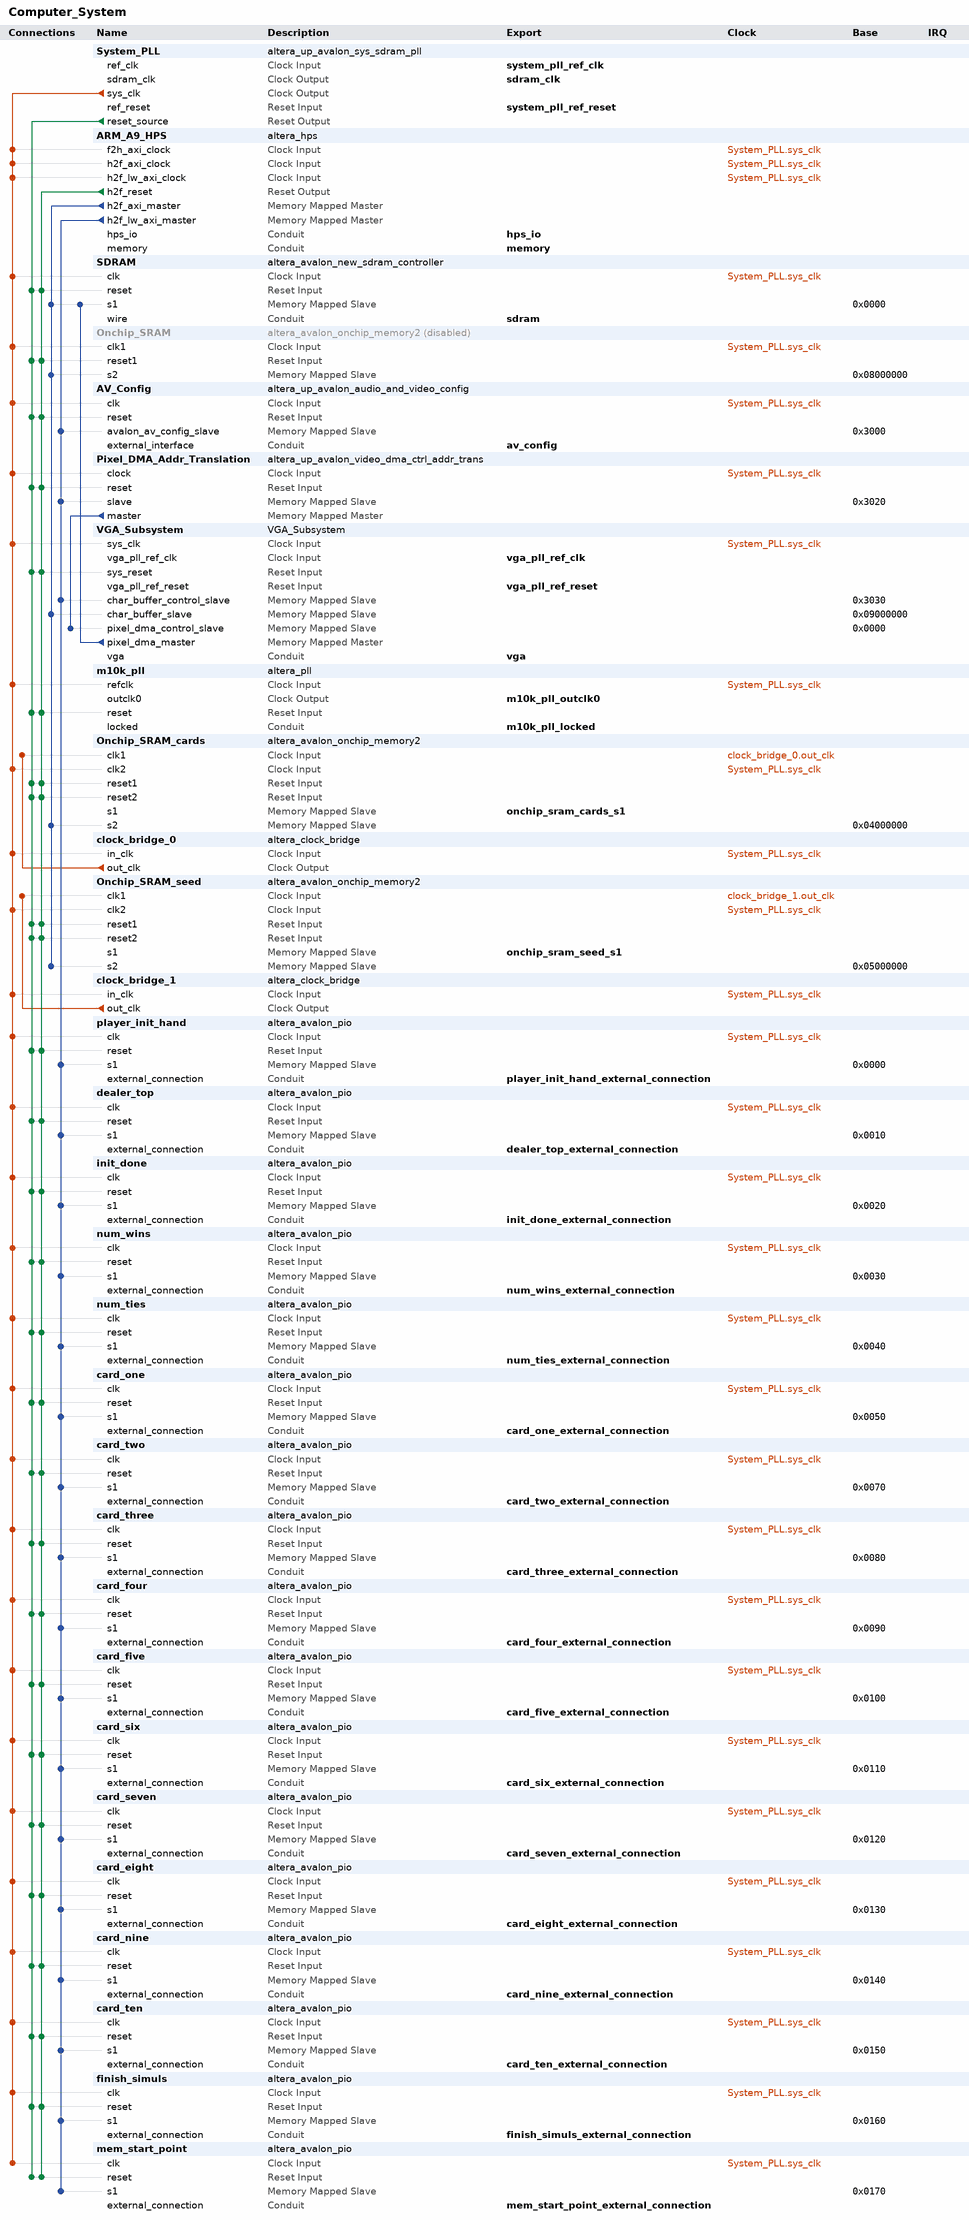
[diagram p0: system contents]
# Platform Designer (Qsys) system Computer_System, Cyclone V 5CSEMA5F31C6
# Parameters at their usual value, and those the tool derives, are not listed.
package require -exact qsys 18.1
create_system Computer_System
set_project_property DEVICE_FAMILY {Cyclone V}
set_project_property DEVICE 5CSEMA5F31C6

add_instance System_PLL altera_up_avalon_sys_sdram_pll 18.0
set_instance_parameter_value System_PLL CV_boards DE1-SoC
set_instance_parameter_value System_PLL gui_outclk 100.0
set_instance_parameter_value System_PLL gui_refclk 50.0

add_instance ARM_A9_HPS altera_hps 18.1
set_instance_parameter_value ARM_A9_HPS EMAC1_Mode RGMII
set_instance_parameter_value ARM_A9_HPS EMAC1_PinMuxing {HPS I/O Set 0}
set_instance_parameter_value ARM_A9_HPS F2SCLK_COLDRST_Enable false
set_instance_parameter_value ARM_A9_HPS F2SCLK_DBGRST_Enable false
set_instance_parameter_value ARM_A9_HPS F2SCLK_WARMRST_Enable false
set_instance_parameter_value ARM_A9_HPS F2SINTERRUPT_Enable true
set_instance_parameter_value ARM_A9_HPS F2S_Width 2
set_instance_parameter_value ARM_A9_HPS FPGA_PERIPHERAL_OUTPUT_CLOCK_FREQ_EMAC0_GTX_CLK 125
set_instance_parameter_value ARM_A9_HPS FPGA_PERIPHERAL_OUTPUT_CLOCK_FREQ_EMAC0_MD_CLK 100.0
set_instance_parameter_value ARM_A9_HPS FPGA_PERIPHERAL_OUTPUT_CLOCK_FREQ_EMAC1_GTX_CLK 125
set_instance_parameter_value ARM_A9_HPS FPGA_PERIPHERAL_OUTPUT_CLOCK_FREQ_EMAC1_MD_CLK 100.0
set_instance_parameter_value ARM_A9_HPS HPS_PROTOCOL DDR3
set_instance_parameter_value ARM_A9_HPS I2C0_Mode I2C
set_instance_parameter_value ARM_A9_HPS I2C0_PinMuxing {HPS I/O Set 0}
set_instance_parameter_value ARM_A9_HPS I2C1_Mode I2C
set_instance_parameter_value ARM_A9_HPS I2C1_PinMuxing {HPS I/O Set 0}
set_instance_parameter_value ARM_A9_HPS LWH2F_Enable true
set_instance_parameter_value ARM_A9_HPS MEM_BANKADDR_WIDTH 3
set_instance_parameter_value ARM_A9_HPS MEM_CLK_FREQ 400.0
set_instance_parameter_value ARM_A9_HPS MEM_COL_ADDR_WIDTH 10
set_instance_parameter_value ARM_A9_HPS MEM_DQ_WIDTH 32
set_instance_parameter_value ARM_A9_HPS MEM_DRV_STR RZQ/7
set_instance_parameter_value ARM_A9_HPS MEM_ROW_ADDR_WIDTH 15
set_instance_parameter_value ARM_A9_HPS MEM_RTT_NOM RZQ/4
set_instance_parameter_value ARM_A9_HPS MEM_RTT_WR RZQ/4
set_instance_parameter_value ARM_A9_HPS MEM_TCL 11
set_instance_parameter_value ARM_A9_HPS MEM_TFAW_NS 30.0
set_instance_parameter_value ARM_A9_HPS MEM_TRAS_NS 35.0
set_instance_parameter_value ARM_A9_HPS MEM_TRCD_NS 13.75
set_instance_parameter_value ARM_A9_HPS MEM_TRFC_NS 260.0
set_instance_parameter_value ARM_A9_HPS MEM_TRP_NS 13.75
set_instance_parameter_value ARM_A9_HPS MEM_VENDOR JEDEC
set_instance_parameter_value ARM_A9_HPS MEM_WTCL 8
set_instance_parameter_value ARM_A9_HPS QSPI_Mode {1 SS}
set_instance_parameter_value ARM_A9_HPS QSPI_PinMuxing {HPS I/O Set 0}
set_instance_parameter_value ARM_A9_HPS REF_CLK_FREQ 25.0
set_instance_parameter_value ARM_A9_HPS S2FCLK_USER2CLK 5
set_instance_parameter_value ARM_A9_HPS S2F_Width 3
set_instance_parameter_value ARM_A9_HPS SDIO_Mode {4-bit Data}
set_instance_parameter_value ARM_A9_HPS SDIO_PinMuxing {HPS I/O Set 0}
set_instance_parameter_value ARM_A9_HPS SPIM1_Mode {Single Slave Select}
set_instance_parameter_value ARM_A9_HPS SPIM1_PinMuxing {HPS I/O Set 0}
set_instance_parameter_value ARM_A9_HPS STM_Enable false
set_instance_parameter_value ARM_A9_HPS TIMING_BOARD_AC_SKEW 0.03
set_instance_parameter_value ARM_A9_HPS TIMING_BOARD_AC_TO_CK_SKEW 0.0
set_instance_parameter_value ARM_A9_HPS TIMING_BOARD_DQ_TO_DQS_SKEW 0.0
set_instance_parameter_value ARM_A9_HPS TIMING_BOARD_MAX_CK_DELAY 0.03
set_instance_parameter_value ARM_A9_HPS TIMING_BOARD_MAX_DQS_DELAY 0.02
set_instance_parameter_value ARM_A9_HPS TIMING_BOARD_SKEW_BETWEEN_DQS 0.08
set_instance_parameter_value ARM_A9_HPS TIMING_BOARD_SKEW_CKDQS_DIMM_MAX 0.16
set_instance_parameter_value ARM_A9_HPS TIMING_BOARD_SKEW_CKDQS_DIMM_MIN 0.09
set_instance_parameter_value ARM_A9_HPS TIMING_BOARD_SKEW_WITHIN_DQS 0.01
set_instance_parameter_value ARM_A9_HPS TIMING_TDH 65
set_instance_parameter_value ARM_A9_HPS TIMING_TDQSCK 255
set_instance_parameter_value ARM_A9_HPS TIMING_TDQSQ 125
set_instance_parameter_value ARM_A9_HPS TIMING_TDS 30
set_instance_parameter_value ARM_A9_HPS TIMING_TIH 140
set_instance_parameter_value ARM_A9_HPS TIMING_TIS 180
set_instance_parameter_value ARM_A9_HPS TIMING_TQSH 0.4
set_instance_parameter_value ARM_A9_HPS UART0_Mode {No Flow Control}
set_instance_parameter_value ARM_A9_HPS UART0_PinMuxing {HPS I/O Set 0}
set_instance_parameter_value ARM_A9_HPS USB1_Mode SDR
set_instance_parameter_value ARM_A9_HPS USB1_PinMuxing {HPS I/O Set 0}
set_instance_parameter_value ARM_A9_HPS desired_cfg_clk_mhz 100.0
set_instance_parameter_value ARM_A9_HPS desired_qspi_clk_mhz 400.0

add_instance SDRAM altera_avalon_new_sdram_controller 18.1
set_instance_parameter_value SDRAM TAC 5.5
set_instance_parameter_value SDRAM TRCD 20.0
set_instance_parameter_value SDRAM TRP 20.0
set_instance_parameter_value SDRAM casLatency 3
set_instance_parameter_value SDRAM columnWidth 10
set_instance_parameter_value SDRAM dataWidth 16
set_instance_parameter_value SDRAM generateSimulationModel true
set_instance_parameter_value SDRAM model single_Micron_MT48LC4M32B2_7_chip
set_instance_parameter_value SDRAM numberOfBanks 4
set_instance_parameter_value SDRAM numberOfChipSelects 1
set_instance_parameter_value SDRAM powerUpDelay 100.0
set_instance_parameter_value SDRAM refreshPeriod 15.625
set_instance_parameter_value SDRAM rowWidth 13

add_instance Onchip_SRAM altera_avalon_onchip_memory2 18.1
set_instance_property Onchip_SRAM ENABLED false
set_instance_parameter_value Onchip_SRAM dataWidth 8
set_instance_parameter_value Onchip_SRAM dualPort true
set_instance_parameter_value Onchip_SRAM initMemContent false
set_instance_parameter_value Onchip_SRAM initializationFileName onchip_mem.hex
set_instance_parameter_value Onchip_SRAM memorySize 131072
set_instance_parameter_value Onchip_SRAM singleClockOperation true

add_instance AV_Config altera_up_avalon_audio_and_video_config 18.0
set_instance_parameter_value AV_Config audio_in {Microphone to ADC}
set_instance_parameter_value AV_Config bit_length 32
set_instance_parameter_value AV_Config board DE1-SoC
set_instance_parameter_value AV_Config line_in_bypass false
set_instance_parameter_value AV_Config sampling_rate {48 kHz}

add_instance Pixel_DMA_Addr_Translation altera_up_avalon_video_dma_ctrl_addr_trans 18.0

add_instance VGA_Subsystem VGA_Subsystem 1.0

add_instance m10k_pll altera_pll 18.1
set_instance_parameter_value m10k_pll gui_device_speed_grade 1
set_instance_parameter_value m10k_pll gui_number_of_clocks 1
set_instance_parameter_value m10k_pll gui_operation_mode direct
set_instance_parameter_value m10k_pll gui_output_clock_frequency0 100.0
set_instance_parameter_value m10k_pll gui_pll_mode {Integer-N PLL}
set_instance_parameter_value m10k_pll gui_reference_clock_frequency 100.0
set_instance_parameter_value m10k_pll gui_use_locked true

add_instance Onchip_SRAM_cards altera_avalon_onchip_memory2 18.1
set_instance_parameter_value Onchip_SRAM_cards blockType M10K
set_instance_parameter_value Onchip_SRAM_cards dataWidth 32
set_instance_parameter_value Onchip_SRAM_cards dualPort true
set_instance_parameter_value Onchip_SRAM_cards initMemContent true
set_instance_parameter_value Onchip_SRAM_cards initializationFileName onchip_mem.hex
set_instance_parameter_value Onchip_SRAM_cards memorySize 1248

add_instance clock_bridge_0 altera_clock_bridge 18.1
set_instance_parameter_value clock_bridge_0 DERIVED_CLOCK_RATE 100000000
set_instance_parameter_value clock_bridge_0 EXPLICIT_CLOCK_RATE 50000000

add_instance Onchip_SRAM_seed altera_avalon_onchip_memory2 18.1
set_instance_parameter_value Onchip_SRAM_seed blockType M10K
set_instance_parameter_value Onchip_SRAM_seed dataWidth 32
set_instance_parameter_value Onchip_SRAM_seed dualPort true
set_instance_parameter_value Onchip_SRAM_seed initMemContent true
set_instance_parameter_value Onchip_SRAM_seed initializationFileName onchip_mem.hex
set_instance_parameter_value Onchip_SRAM_seed memorySize 10000

add_instance clock_bridge_1 altera_clock_bridge 18.1
set_instance_parameter_value clock_bridge_1 DERIVED_CLOCK_RATE 100000000
set_instance_parameter_value clock_bridge_1 EXPLICIT_CLOCK_RATE 50000000

add_instance player_init_hand altera_avalon_pio 18.1
set_instance_parameter_value player_init_hand direction Output
set_instance_parameter_value player_init_hand width 8

add_instance dealer_top altera_avalon_pio 18.1
set_instance_parameter_value dealer_top direction Output
set_instance_parameter_value dealer_top width 8

add_instance init_done altera_avalon_pio 18.1
set_instance_parameter_value init_done direction Output
set_instance_parameter_value init_done width 8

add_instance num_wins altera_avalon_pio 18.1
set_instance_parameter_value num_wins direction Input
set_instance_parameter_value num_wins width 32

add_instance num_ties altera_avalon_pio 18.1
set_instance_parameter_value num_ties direction Input
set_instance_parameter_value num_ties width 32

add_instance card_one altera_avalon_pio 18.1
set_instance_parameter_value card_one direction Input
set_instance_parameter_value card_one width 32

add_instance card_two altera_avalon_pio 18.1
set_instance_parameter_value card_two direction Input
set_instance_parameter_value card_two width 32

add_instance card_three altera_avalon_pio 18.1
set_instance_parameter_value card_three direction Input
set_instance_parameter_value card_three width 32

add_instance card_four altera_avalon_pio 18.1
set_instance_parameter_value card_four direction Input
set_instance_parameter_value card_four width 32

add_instance card_five altera_avalon_pio 18.1
set_instance_parameter_value card_five direction Input
set_instance_parameter_value card_five width 32

add_instance card_six altera_avalon_pio 18.1
set_instance_parameter_value card_six direction Input
set_instance_parameter_value card_six width 32

add_instance card_seven altera_avalon_pio 18.1
set_instance_parameter_value card_seven direction Input
set_instance_parameter_value card_seven width 32

add_instance card_eight altera_avalon_pio 18.1
set_instance_parameter_value card_eight direction Input
set_instance_parameter_value card_eight width 32

add_instance card_nine altera_avalon_pio 18.1
set_instance_parameter_value card_nine direction Input
set_instance_parameter_value card_nine width 32

add_instance card_ten altera_avalon_pio 18.1
set_instance_parameter_value card_ten direction Input
set_instance_parameter_value card_ten width 32

add_instance finish_simuls altera_avalon_pio 18.1
set_instance_parameter_value finish_simuls direction Input
set_instance_parameter_value finish_simuls width 32

add_instance mem_start_point altera_avalon_pio 18.1
set_instance_parameter_value mem_start_point direction Output
set_instance_parameter_value mem_start_point width 32

# connections
add_connection clock_bridge_0.out_clk Onchip_SRAM_cards.clk1 clock
add_connection clock_bridge_1.out_clk Onchip_SRAM_seed.clk1 clock
add_connection System_PLL.sys_clk ARM_A9_HPS.f2h_axi_clock clock
add_connection System_PLL.sys_clk ARM_A9_HPS.h2f_axi_clock clock
add_connection System_PLL.sys_clk ARM_A9_HPS.h2f_lw_axi_clock clock
add_connection System_PLL.sys_clk AV_Config.clk clock
add_connection System_PLL.sys_clk card_eight.clk clock
add_connection System_PLL.sys_clk card_five.clk clock
add_connection System_PLL.sys_clk card_four.clk clock
add_connection System_PLL.sys_clk card_nine.clk clock
add_connection System_PLL.sys_clk card_one.clk clock
add_connection System_PLL.sys_clk card_seven.clk clock
add_connection System_PLL.sys_clk card_six.clk clock
add_connection System_PLL.sys_clk card_ten.clk clock
add_connection System_PLL.sys_clk card_three.clk clock
add_connection System_PLL.sys_clk card_two.clk clock
add_connection System_PLL.sys_clk clock_bridge_0.in_clk clock
add_connection System_PLL.sys_clk clock_bridge_1.in_clk clock
add_connection System_PLL.sys_clk dealer_top.clk clock
add_connection System_PLL.sys_clk finish_simuls.clk clock
add_connection System_PLL.sys_clk init_done.clk clock
add_connection System_PLL.sys_clk m10k_pll.refclk clock
add_connection System_PLL.sys_clk mem_start_point.clk clock
add_connection System_PLL.sys_clk num_ties.clk clock
add_connection System_PLL.sys_clk num_wins.clk clock
add_connection System_PLL.sys_clk Onchip_SRAM.clk1 clock
add_connection System_PLL.sys_clk Onchip_SRAM_cards.clk2 clock
add_connection System_PLL.sys_clk Onchip_SRAM_seed.clk2 clock
add_connection System_PLL.sys_clk Pixel_DMA_Addr_Translation.clock clock
add_connection System_PLL.sys_clk player_init_hand.clk clock
add_connection System_PLL.sys_clk SDRAM.clk clock
add_connection System_PLL.sys_clk VGA_Subsystem.sys_clk clock
add_connection ARM_A9_HPS.h2f_reset AV_Config.reset reset
add_connection ARM_A9_HPS.h2f_reset card_eight.reset reset
add_connection ARM_A9_HPS.h2f_reset card_five.reset reset
add_connection ARM_A9_HPS.h2f_reset card_four.reset reset
add_connection ARM_A9_HPS.h2f_reset card_nine.reset reset
add_connection ARM_A9_HPS.h2f_reset card_one.reset reset
add_connection ARM_A9_HPS.h2f_reset card_seven.reset reset
add_connection ARM_A9_HPS.h2f_reset card_six.reset reset
add_connection ARM_A9_HPS.h2f_reset card_ten.reset reset
add_connection ARM_A9_HPS.h2f_reset card_three.reset reset
add_connection ARM_A9_HPS.h2f_reset card_two.reset reset
add_connection ARM_A9_HPS.h2f_reset dealer_top.reset reset
add_connection ARM_A9_HPS.h2f_reset finish_simuls.reset reset
add_connection ARM_A9_HPS.h2f_reset init_done.reset reset
add_connection ARM_A9_HPS.h2f_reset m10k_pll.reset reset
add_connection ARM_A9_HPS.h2f_reset mem_start_point.reset reset
add_connection ARM_A9_HPS.h2f_reset num_ties.reset reset
add_connection ARM_A9_HPS.h2f_reset num_wins.reset reset
add_connection ARM_A9_HPS.h2f_reset Onchip_SRAM.reset1 reset
add_connection ARM_A9_HPS.h2f_reset Onchip_SRAM_cards.reset1 reset
add_connection ARM_A9_HPS.h2f_reset Onchip_SRAM_cards.reset2 reset
add_connection ARM_A9_HPS.h2f_reset Onchip_SRAM_seed.reset1 reset
add_connection ARM_A9_HPS.h2f_reset Onchip_SRAM_seed.reset2 reset
add_connection ARM_A9_HPS.h2f_reset Pixel_DMA_Addr_Translation.reset reset
add_connection ARM_A9_HPS.h2f_reset player_init_hand.reset reset
add_connection ARM_A9_HPS.h2f_reset SDRAM.reset reset
add_connection ARM_A9_HPS.h2f_reset VGA_Subsystem.sys_reset reset
add_connection System_PLL.reset_source AV_Config.reset reset
add_connection System_PLL.reset_source card_eight.reset reset
add_connection System_PLL.reset_source card_five.reset reset
add_connection System_PLL.reset_source card_four.reset reset
add_connection System_PLL.reset_source card_nine.reset reset
add_connection System_PLL.reset_source card_one.reset reset
add_connection System_PLL.reset_source card_seven.reset reset
add_connection System_PLL.reset_source card_six.reset reset
add_connection System_PLL.reset_source card_ten.reset reset
add_connection System_PLL.reset_source card_three.reset reset
add_connection System_PLL.reset_source card_two.reset reset
add_connection System_PLL.reset_source dealer_top.reset reset
add_connection System_PLL.reset_source finish_simuls.reset reset
add_connection System_PLL.reset_source init_done.reset reset
add_connection System_PLL.reset_source m10k_pll.reset reset
add_connection System_PLL.reset_source mem_start_point.reset reset
add_connection System_PLL.reset_source num_ties.reset reset
add_connection System_PLL.reset_source num_wins.reset reset
add_connection System_PLL.reset_source Onchip_SRAM.reset1 reset
add_connection System_PLL.reset_source Onchip_SRAM_cards.reset1 reset
add_connection System_PLL.reset_source Onchip_SRAM_cards.reset2 reset
add_connection System_PLL.reset_source Onchip_SRAM_seed.reset1 reset
add_connection System_PLL.reset_source Onchip_SRAM_seed.reset2 reset
add_connection System_PLL.reset_source Pixel_DMA_Addr_Translation.reset reset
add_connection System_PLL.reset_source player_init_hand.reset reset
add_connection System_PLL.reset_source SDRAM.reset reset
add_connection System_PLL.reset_source VGA_Subsystem.sys_reset reset
add_connection ARM_A9_HPS.h2f_axi_master Onchip_SRAM.s2 avalon
set_connection_parameter_value ARM_A9_HPS.h2f_axi_master/Onchip_SRAM.s2 baseAddress 0x08000000
add_connection ARM_A9_HPS.h2f_axi_master Onchip_SRAM_cards.s2 avalon
set_connection_parameter_value ARM_A9_HPS.h2f_axi_master/Onchip_SRAM_cards.s2 baseAddress 0x04000000
add_connection ARM_A9_HPS.h2f_axi_master Onchip_SRAM_seed.s2 avalon
set_connection_parameter_value ARM_A9_HPS.h2f_axi_master/Onchip_SRAM_seed.s2 baseAddress 0x05000000
add_connection ARM_A9_HPS.h2f_axi_master SDRAM.s1 avalon
set_connection_parameter_value ARM_A9_HPS.h2f_axi_master/SDRAM.s1 baseAddress 0x0000
add_connection ARM_A9_HPS.h2f_axi_master VGA_Subsystem.char_buffer_slave avalon
set_connection_parameter_value ARM_A9_HPS.h2f_axi_master/VGA_Subsystem.char_buffer_slave baseAddress 0x09000000
add_connection ARM_A9_HPS.h2f_lw_axi_master AV_Config.avalon_av_config_slave avalon
set_connection_parameter_value ARM_A9_HPS.h2f_lw_axi_master/AV_Config.avalon_av_config_slave baseAddress 0x3000
add_connection ARM_A9_HPS.h2f_lw_axi_master card_eight.s1 avalon
set_connection_parameter_value ARM_A9_HPS.h2f_lw_axi_master/card_eight.s1 baseAddress 0x0130
add_connection ARM_A9_HPS.h2f_lw_axi_master card_five.s1 avalon
set_connection_parameter_value ARM_A9_HPS.h2f_lw_axi_master/card_five.s1 baseAddress 0x0100
add_connection ARM_A9_HPS.h2f_lw_axi_master card_four.s1 avalon
set_connection_parameter_value ARM_A9_HPS.h2f_lw_axi_master/card_four.s1 baseAddress 0x0090
add_connection ARM_A9_HPS.h2f_lw_axi_master card_nine.s1 avalon
set_connection_parameter_value ARM_A9_HPS.h2f_lw_axi_master/card_nine.s1 baseAddress 0x0140
add_connection ARM_A9_HPS.h2f_lw_axi_master card_one.s1 avalon
set_connection_parameter_value ARM_A9_HPS.h2f_lw_axi_master/card_one.s1 baseAddress 0x0050
add_connection ARM_A9_HPS.h2f_lw_axi_master card_seven.s1 avalon
set_connection_parameter_value ARM_A9_HPS.h2f_lw_axi_master/card_seven.s1 baseAddress 0x0120
add_connection ARM_A9_HPS.h2f_lw_axi_master card_six.s1 avalon
set_connection_parameter_value ARM_A9_HPS.h2f_lw_axi_master/card_six.s1 baseAddress 0x0110
add_connection ARM_A9_HPS.h2f_lw_axi_master card_ten.s1 avalon
set_connection_parameter_value ARM_A9_HPS.h2f_lw_axi_master/card_ten.s1 baseAddress 0x0150
add_connection ARM_A9_HPS.h2f_lw_axi_master card_three.s1 avalon
set_connection_parameter_value ARM_A9_HPS.h2f_lw_axi_master/card_three.s1 baseAddress 0x0080
add_connection ARM_A9_HPS.h2f_lw_axi_master card_two.s1 avalon
set_connection_parameter_value ARM_A9_HPS.h2f_lw_axi_master/card_two.s1 baseAddress 0x0070
add_connection ARM_A9_HPS.h2f_lw_axi_master dealer_top.s1 avalon
set_connection_parameter_value ARM_A9_HPS.h2f_lw_axi_master/dealer_top.s1 baseAddress 0x0010
add_connection ARM_A9_HPS.h2f_lw_axi_master finish_simuls.s1 avalon
set_connection_parameter_value ARM_A9_HPS.h2f_lw_axi_master/finish_simuls.s1 baseAddress 0x0160
add_connection ARM_A9_HPS.h2f_lw_axi_master init_done.s1 avalon
set_connection_parameter_value ARM_A9_HPS.h2f_lw_axi_master/init_done.s1 baseAddress 0x0020
add_connection ARM_A9_HPS.h2f_lw_axi_master mem_start_point.s1 avalon
set_connection_parameter_value ARM_A9_HPS.h2f_lw_axi_master/mem_start_point.s1 baseAddress 0x0170
add_connection ARM_A9_HPS.h2f_lw_axi_master num_ties.s1 avalon
set_connection_parameter_value ARM_A9_HPS.h2f_lw_axi_master/num_ties.s1 baseAddress 0x0040
add_connection ARM_A9_HPS.h2f_lw_axi_master num_wins.s1 avalon
set_connection_parameter_value ARM_A9_HPS.h2f_lw_axi_master/num_wins.s1 baseAddress 0x0030
add_connection ARM_A9_HPS.h2f_lw_axi_master Pixel_DMA_Addr_Translation.slave avalon
set_connection_parameter_value ARM_A9_HPS.h2f_lw_axi_master/Pixel_DMA_Addr_Translation.slave baseAddress 0x3020
add_connection ARM_A9_HPS.h2f_lw_axi_master player_init_hand.s1 avalon
set_connection_parameter_value ARM_A9_HPS.h2f_lw_axi_master/player_init_hand.s1 baseAddress 0x0000
add_connection ARM_A9_HPS.h2f_lw_axi_master VGA_Subsystem.char_buffer_control_slave avalon
set_connection_parameter_value ARM_A9_HPS.h2f_lw_axi_master/VGA_Subsystem.char_buffer_control_slave baseAddress 0x3030
add_connection Pixel_DMA_Addr_Translation.master VGA_Subsystem.pixel_dma_control_slave avalon
set_connection_parameter_value Pixel_DMA_Addr_Translation.master/VGA_Subsystem.pixel_dma_control_slave baseAddress 0x0000
add_connection VGA_Subsystem.pixel_dma_master SDRAM.s1 avalon
set_connection_parameter_value VGA_Subsystem.pixel_dma_master/SDRAM.s1 baseAddress 0x0000

# exported interfaces
add_interface av_config conduit end
set_interface_property av_config EXPORT_OF AV_Config.external_interface
add_interface card_eight_external_connection conduit end
set_interface_property card_eight_external_connection EXPORT_OF card_eight.external_connection
add_interface card_five_external_connection conduit end
set_interface_property card_five_external_connection EXPORT_OF card_five.external_connection
add_interface card_four_external_connection conduit end
set_interface_property card_four_external_connection EXPORT_OF card_four.external_connection
add_interface card_nine_external_connection conduit end
set_interface_property card_nine_external_connection EXPORT_OF card_nine.external_connection
add_interface card_one_external_connection conduit end
set_interface_property card_one_external_connection EXPORT_OF card_one.external_connection
add_interface card_seven_external_connection conduit end
set_interface_property card_seven_external_connection EXPORT_OF card_seven.external_connection
add_interface card_six_external_connection conduit end
set_interface_property card_six_external_connection EXPORT_OF card_six.external_connection
add_interface card_ten_external_connection conduit end
set_interface_property card_ten_external_connection EXPORT_OF card_ten.external_connection
add_interface card_three_external_connection conduit end
set_interface_property card_three_external_connection EXPORT_OF card_three.external_connection
add_interface card_two_external_connection conduit end
set_interface_property card_two_external_connection EXPORT_OF card_two.external_connection
add_interface dealer_top_external_connection conduit end
set_interface_property dealer_top_external_connection EXPORT_OF dealer_top.external_connection
add_interface finish_simuls_external_connection conduit end
set_interface_property finish_simuls_external_connection EXPORT_OF finish_simuls.external_connection
add_interface hps_io conduit end
set_interface_property hps_io EXPORT_OF ARM_A9_HPS.hps_io
add_interface init_done_external_connection conduit end
set_interface_property init_done_external_connection EXPORT_OF init_done.external_connection
add_interface m10k_pll_locked conduit end
set_interface_property m10k_pll_locked EXPORT_OF m10k_pll.locked
add_interface m10k_pll_outclk0 clock source
set_interface_property m10k_pll_outclk0 EXPORT_OF m10k_pll.outclk0
add_interface mem_start_point_external_connection conduit end
set_interface_property mem_start_point_external_connection EXPORT_OF mem_start_point.external_connection
add_interface memory conduit end
set_interface_property memory EXPORT_OF ARM_A9_HPS.memory
add_interface num_ties_external_connection conduit end
set_interface_property num_ties_external_connection EXPORT_OF num_ties.external_connection
add_interface num_wins_external_connection conduit end
set_interface_property num_wins_external_connection EXPORT_OF num_wins.external_connection
add_interface onchip_sram_cards_s1 avalon slave
set_interface_property onchip_sram_cards_s1 EXPORT_OF Onchip_SRAM_cards.s1
add_interface onchip_sram_seed_s1 avalon slave
set_interface_property onchip_sram_seed_s1 EXPORT_OF Onchip_SRAM_seed.s1
add_interface player_init_hand_external_connection conduit end
set_interface_property player_init_hand_external_connection EXPORT_OF player_init_hand.external_connection
add_interface sdram conduit end
set_interface_property sdram EXPORT_OF SDRAM.wire
add_interface sdram_clk clock source
set_interface_property sdram_clk EXPORT_OF System_PLL.sdram_clk
add_interface system_pll_ref_clk clock sink
set_interface_property system_pll_ref_clk EXPORT_OF System_PLL.ref_clk
add_interface system_pll_ref_reset reset sink
set_interface_property system_pll_ref_reset EXPORT_OF System_PLL.ref_reset
add_interface vga conduit end
set_interface_property vga EXPORT_OF VGA_Subsystem.vga
add_interface vga_pll_ref_clk clock sink
set_interface_property vga_pll_ref_clk EXPORT_OF VGA_Subsystem.vga_pll_ref_clk
add_interface vga_pll_ref_reset reset sink
set_interface_property vga_pll_ref_reset EXPORT_OF VGA_Subsystem.vga_pll_ref_reset

set_interconnect_requirement {$system} qsys_mm.clockCrossingAdapter HANDSHAKE
set_interconnect_requirement {$system} qsys_mm.enableEccProtection FALSE
set_interconnect_requirement {$system} qsys_mm.insertDefaultSlave FALSE
set_interconnect_requirement {$system} qsys_mm.maxAdditionalLatency 1

save_system Computer_System.qsys
